# EAGLE schematic mailbox_schematic (EAGLE 9.6.2)
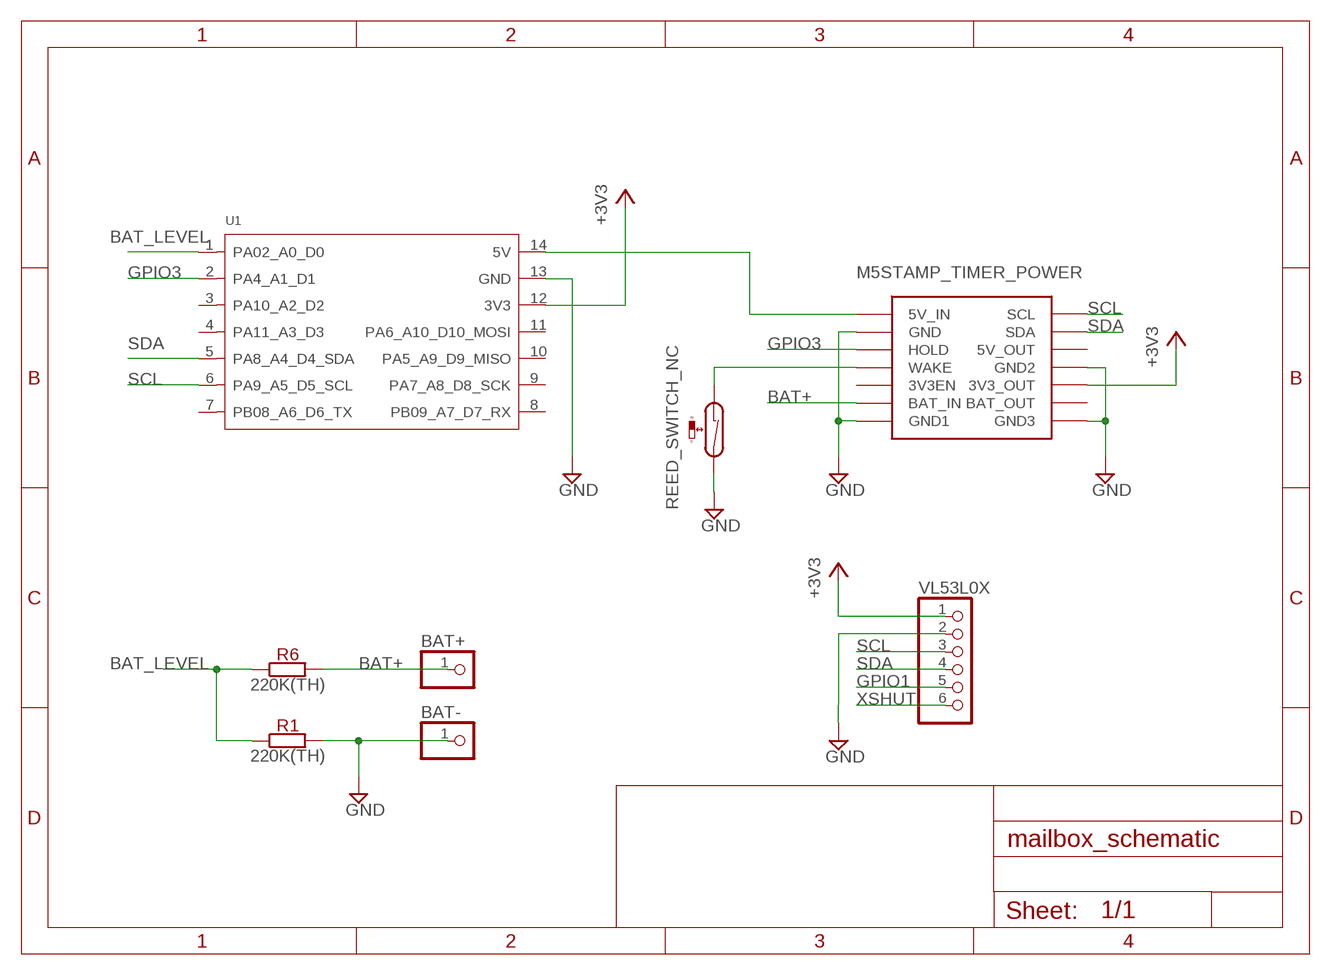
[diagram p0: schematic, sheet 1]

## Parts
BAT+  PINHD-1X1  [1X01]
BAT-  PINHD-1X1  [1X01]
M5STAMP_TIMER_POWER  M5STAMP_TIMER_POWER  [M5STAMP_TIMER_POWER]
R1  220K(TH)  [R-0207/10]
R6  220K(TH)  [R-0207/10]
S1  REED_SWITCH_NC  REED-SWITCH-MK6-4  [MK6-4]
U1  MOUDLE-SEEEDUINO-XIAO-ESP32C3THT  [MOUDLE14P-2.54-21X17.8MM]
VL53L0X  PINHD-1X06_2.54  [1X06]

## Nets
+3V3: M5STAMP_TIMER_POWER.3V3_OUT U1.12(3V3) VL53L0X.1
BAT+: BAT+.1 M5STAMP_TIMER_POWER.BAT_IN R6.2
BAT_LEVEL: R1.1 R6.1 U1.1(PA02_A0_D0)
GND: BAT-.1 M5STAMP_TIMER_POWER.GND M5STAMP_TIMER_POWER.GND1 M5STAMP_TIMER_POWER.GND2 M5STAMP_TIMER_POWER.GND3 R1.2 S1.2 U1.13(GND) VL53L0X.2
GPIO1: VL53L0X.5
GPIO3: M5STAMP_TIMER_POWER.HOLD U1.2(PA4_A1_D1)
N$1: M5STAMP_TIMER_POWER.WAKE S1.1
N$7: M5STAMP_TIMER_POWER.5V_IN U1.14(5V)
SCL: M5STAMP_TIMER_POWER.SCL U1.6(PA9_A5_D5_SCL) VL53L0X.3
SDA: M5STAMP_TIMER_POWER.SDA U1.5(PA8_A4_D4_SDA) VL53L0X.4
XSHUT: VL53L0X.6
Unconnected: M5STAMP_TIMER_POWER.3V3EN M5STAMP_TIMER_POWER.5V_OUT M5STAMP_TIMER_POWER.BAT_OUT U1.3(PA10_A2_D2) U1.4(PA11_A3_D3) U1.7(PB08_A6_D6_TX) U1.8(PB09_A7_D7_RX) U1.9(PA7_A8_D8_SCK) U1.10(PA5_A9_D9_MISO) U1.11(PA6_A10_D10_MOSI)

## Library data of the parts
BAT+ BAT- = adafruit:PINHD-1X1: Pin header 1x1 for 0.1" spacing With round pins
M5STAMP_TIMER_POWER = m5stamp_timer_power:M5STAMP_TIMER_POWER
R1 R6 = resistors:?
S1 = switch-reed:REED-SWITCH-: Reed Sensor; OC_FARNELL: unknown
U1 = Seeed-Studio-XIAO-ESP32C3-footprint-eagle:MOUDLE-SEEEDUINO-XIAO-ESP32C3
VL53L0X = pinhead-2:PINHD-1X06: PIN HEADER